# EAGLE design Servorino (EAGLE 9.6.2)
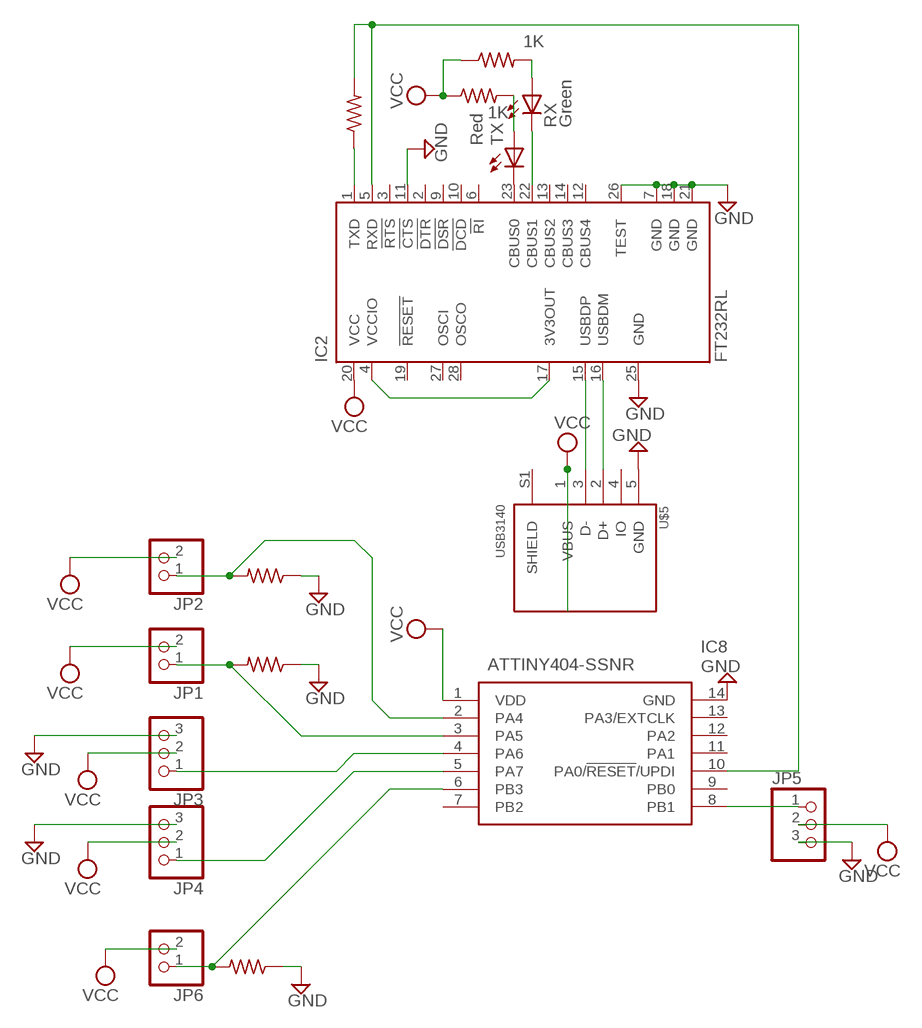
[diagram p0: schematic, sheet 1]

## Parts
IC2  FT232RL  [SSOP28]
IC8  ATTINY404-SSNR  [SOIC127P600X175-14N]
JP1  PINHD-1X2  [1X02]
JP2  PINHD-1X2  [1X02]
JP3  PINHD-1X3  [1X03]
JP4  PINHD-1X3  [1X03]
JP5  PINHD-1X3  [1X03]
JP6  PINHD-1X2  [1X02]
R1  470  R-US_R0805  [R0805]
R2  1K  R-US_R0805  [R0805]
R3  1K  R-US_R0805  [R0805]
R4  470  R-US_R0805  [R0805]
R5  470  R-US_R0805  [R0805]
R6  470  R-US_R0805  [R0805]
RX  Green  LEDCHIP-LED0805  [CHIP-LED0805]
TX  Red  LEDCHIP-LED0805  [CHIP-LED0805]
U$5  USB3140  [USB3140-30-0170-0-C]

## Nets
GND: IC2.7(GND) IC2.11(!CTS) IC2.18(GND) IC2.21(GND) IC2.25(GND) IC2.26(TEST) IC8.14(GND) JP3.3 JP4.3 JP5.3 R4.1 R5.1 R6.1 U$5.5(GND)
N$1: IC8.2(PA4) JP2.1 R6.2
N$2: IC8.6(PB3) JP6.1 R4.2
N$3: IC8.8(PB1) JP5.1
N$4: IC8.3(PA5) JP1.1 R5.2
N$5: IC8.4(PA6) JP3.1
N$6: IC8.5(PA7) JP4.1
N$99: IC2.16(USBDM) U$5.2(D+)
N$100: IC2.15(USBDP) U$5.3(D-)
N$101: IC2.4(VCCIO) IC2.17(3V3OUT)
N$102: IC2.1(TXD) R1.1
N$103: IC2.5(RXD) IC8.10(PA0/!RESET!/UPDI) R1.2
N$104: R2.2 RX.A
N$105: R3.2 TX.A
N$106: IC2.23(CBUS0) TX.C
N$107: IC2.22(CBUS1) RX.C
VCC: IC2.20(VCC) IC8.1(VDD) JP1.2 JP2.2 JP3.2 JP4.2 JP5.2 JP6.2 R2.1 R3.1 U$5.1(VBUS)
Unconnected: IC2.2(!DTR) IC2.3(!RTS) IC2.6(!RI) IC2.9(!DSR) IC2.10(!DCD) IC2.12(CBUS4) IC2.13(CBUS2) IC2.14(CBUS3) IC2.19(!RESET) IC2.27(OSCI) IC2.28(OSCO) IC8.7(PB2) IC8.9(PB0) IC8.11(PA1) IC8.12(PA2) IC8.13(PA3/EXTCLK) U$5.4(IO) U$5.S1(SHIELD)

## Library data of the parts
IC2 = ftdichip:FT232R: Source: http://www.ftdichip.com/Documents/DataSheets/DS_FT232R_v104.pdf; MPN: FT232RL; OC_FARNELL: 1146032; OC_NEWARK: 91K9918
IC8 = SamacSys_Parts:ATTINY404-SSNR: MICROCHIP - ATTINY404-SSNR - MCU, 8BIT, 20MHZ, SOIC-14 Source: Datasheet <https://datasheet.datasheetarchive.com/originals/distributors/DKDS-39/8204.pdf>; DESCRIPTION: MICROCHIP - ATTINY404-SSNR - MCU, 8BIT, 20MHZ, SOIC-14; HEIGHT: 1.75mm; MANUFACTURER_NAME: Microchip; MANUFACTURER_PART_NUMBER: ATTINY404-SSNR; MOUSER_PART_NUMBER: 556-ATTINY404-SSNR; MOUSER_PRICE-STOCK: https://www.mouser.co.uk/ProductDetail/Microchip-Technology-Atmel/ATTINY404-SSNR?qs=F5EMLAvA7IAEqD7Aw0z%252B9Q%3D%3D
JP1 JP2 JP6 = pinhead:PINHD-1X2: PIN HEADER
JP3-JP5 = pinhead:PINHD-1X3: PIN HEADER
R1-R6 = adafruit:R-US_: RESISTOR, American symbol
RX TX = adafruit:LED: LED OSRAM: - CHIPLED LG R971, LG N971, LY N971, LG Q971, LY Q971, LO R971, LY R971 LH N974, LH R974 LS Q976, LO Q976, LY Q976 LO Q996 - Hyper CHIPLED LW Q18S LB Q993, LB Q99A, LB R99A - SideLED LS A670, LO A670, LY A670, LG A670, LP A670 LB A673, LV A673, LT A673, LW A673 LH A674 LY A675 LS A676, LA A676, LO A676, LY A676, LW A676 LS A679, LY A679, LG A679 - Hyper Micro SIDELED® LS Y876, LA Y876, LO Y876, LY Y876 LT Y87S - SmartLED LW L88C, LW L88S LB L89C, LB L89S, LG L890 LS L89K, LO L89K, LY L89K LS L896, LA L896, LO L896, LY L896 - TOPLED LS T670, LO T670, LY T670, LG T670, LP T670 LSG T670, LSP T670, LSY T670, LOP T670, LYG T670 LG T671, LOG T671, LSG T671 LB T673, LV T673, LT T673, LW T673 LH T674 LS T676, LA T676, LO T676, LY T676, LB T676, LH T676, LSB T676, LW T676 LB T67C, LV T67C, LT T67C, LS T67K, LO T67K, LY T67K, LW E67C LS E67B, LA E67B, LO E67B, LY E67B, LB E67C, LV E67C, LT E67C LW T67C LS T679, LY T679, LG T679 LS T770, LO T770, LY T770, LG T770, LP T770 LB T773, LV T773, LT T773, LW T773 LH T774 LS E675, LA E675, LY E675, LS T675 LS T776, LA T776, LO T776, LY T776, LB T776 LHGB T686 LT T68C, LB T68C - Hyper Mini TOPLED® LB M676 - Mini TOPLED Santana® LG M470 LS M47K, LO M47K, LY M47K Source: http://www.osram.convergy.de/
U$5 = USB:USB3140

## Board
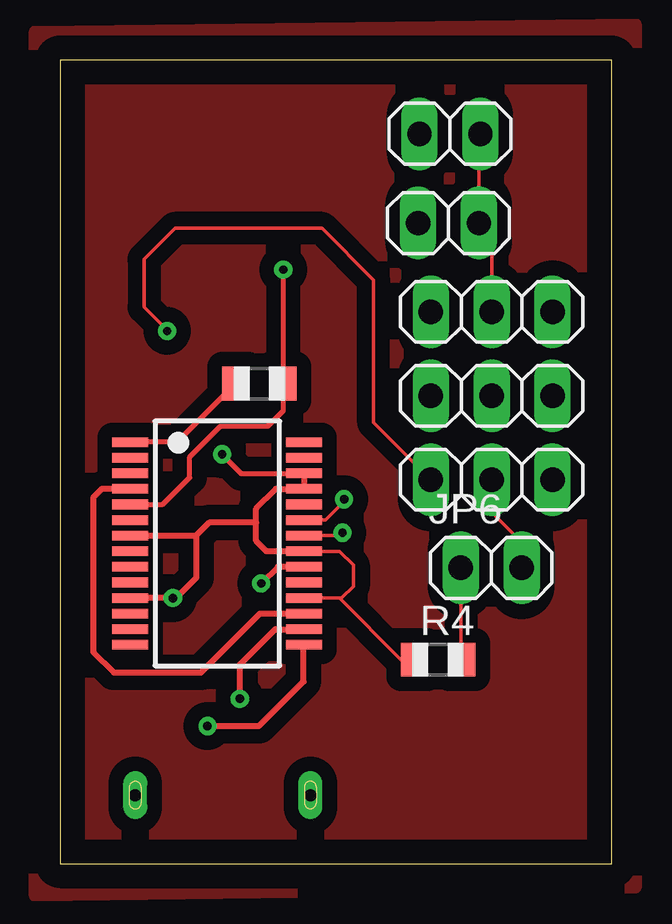
[diagram p1: board, top side]
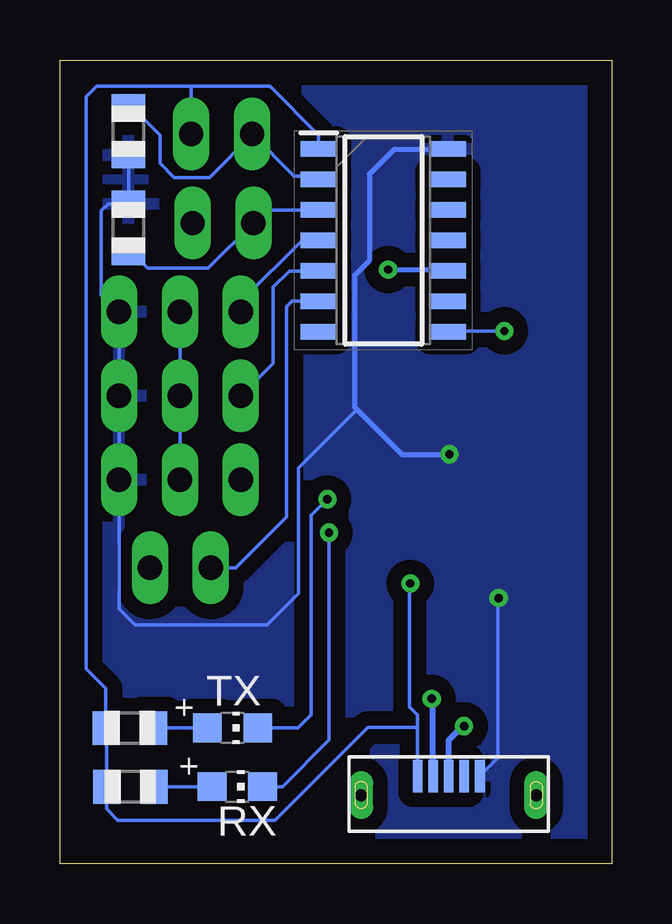
[diagram p2: board, bottom side, seen from below]

Size 23 x 33.5 mm. Coordinates in mm from the lower left corner, seen from the top.
Outline: 0,0 23,0 23,33.5 0,33.5 0,0
Copper layers (1*16): Top 0.035mm / dielectric 1.5mm / Bottom 0.035mm
Design rules "default": minimum track width 6mil, minimum drill 0.35mm, track to track 6mil, track to pad 6mil, pad to pad 6mil, via to via 6mil, smd to smd 6mil, copper to edge 40mil, drill to drill 6mil, minimum pad ring 10mil, minimum via ring 8mil, stop-mask expansion 4mil, vias tented up to drill 0mil, thermal gap 10mil

### Footprints (pad centres in the part's own frame; a part is rotated, then mirrored left to right if it is on the bottom)
SSOP28 = smd 0.4 x 1.5: 1 -4.225,-3.625; 2 -3.575,-3.625; 3 -2.925,-3.625; 4 -2.275,-3.625; 5 -1.625,-3.625; 6 -0.975,-3.625; 7 -0.325,-3.625; 8 0.325,-3.625; 9 0.975,-3.625; 10 1.625,-3.625; 11 2.275,-3.625; 12 2.925,-3.625; 13 3.575,-3.625; 14 4.225,-3.625; 15 4.225,3.625; 16 3.575,3.625; 17 2.925,3.625; 18 2.275,3.625; 19 1.625,3.625; 20 0.975,3.625; 21 0.325,3.625; 22 -0.325,3.625; 23 -0.975,3.625; 24 -1.625,3.625; 25 -2.275,3.625; 26 -2.925,3.625; 27 -3.575,3.625; 28 -4.225,3.625
SOIC127P600X175-14N = smd 1.5 x 0.65: 1 -2.7,3.81; 2 -2.7,2.54; 3 -2.7,1.27; 4 -2.7,0; 5 -2.7,-1.27; 6 -2.7,-2.54; 7 -2.7,-3.81; 8 2.7,-3.81; 9 2.7,-2.54; 10 2.7,-1.27; 11 2.7,0; 12 2.7,1.27; 13 2.7,2.54; 14 2.7,3.81
1X02 = drill 1.016 long: 1 -1.27,0; 2 1.27,0
1X03 = drill 1.016 long: 1 -2.54,0; 2 0,0; 3 2.54,0
R0805 = smd 1.1 x 1.4: 1 -1,0; 2 1,0
CHIP-LED0805 = smd 1.2 x 1.2: A 0,-1.05; C 0,1.05
USB3140-30-0170-0-C = smd 0.4 x 1.35: 1 -1.3,0; 2 -0.65,0; 3 0,0; 4 0.65,0; 5 1.3,0 | drill 0.5 pad 0.775 long: S1 3.65,-0.8; S3 -3.65,-0.8

### Placement (x,y rotation side)
IC2  6.56,13.35 270 top
IC8  9.51,25.98 0 bottom
JP1  16.2,26.7 0 top
JP2  16.26,30.42 0 top
JP3  18,23 0 top
JP4  18,19.5 0 top
JP5  18,16 0 top
JP6  17.98,12.33 0 top
R1  8.32,20.01 0 top
R2  20.06,3.2 0 bottom
R3  20.09,5.65 0 bottom
R4  15.77,8.5 0 top
R5  20.14,26.5 270 bottom
R6  20.14,30.53 90 bottom
RX  15.61,3.21 270 bottom
TX  15.8,5.66 270 bottom
U$5  6.79,3.65 0 bottom

### Tracks (layer width: path | path; a pad name or v marks a point on that pad's centre or on a via)
GND  (via drill 0.35)
  Top 0.152: IC2.21 11.65,13.02 12.23,12.44 12.23,11.56 11.74,11.07 11.65,11.07 | 11.65,11.07 IC2.18 | R4.1 14.22,8.5 11.65,11.07
  Top 0.2: v6.76,17.06 7.56,16.26 10.18,16.26
  Top 0.254: IC2.21 8.61,13.02 8.18,13.45 8.18,14.21 | 8.18,14.21 8.18,14.8 9,15.62 IC2.25 IC2.26 10.18,16.26 | 8.18,14.21 6.22,14.21 5.68,13.67 | IC2.7 5.68,13.67 | 5.68,13.67 5.68,11.91 4.84,11.07 v4.71,11.07 IC2.11
  Bottom 0.152: U$5.5 4.74,4.4 4.74,11.09 4.73,11.09 v4.71,11.07 | 20.54,22.96 JP4.3 JP5.3 20.54,10.61 19.87,9.94 14.37,9.94 13.05,11.26 13.05,16.48 10.61,18.93 | 20.54,22.96 JP3.3 | 20.54,22.96 21.28,23.7 21.28,27.22 21,27.5 R5.1 R6.1
  Bottom 0.2: v6.76,17.06 8.74,17.06 10.61,18.93 10.72,19.04 10.72,24.52 10.1,25.14 10.1,28.74 9.05,29.79 IC8.14
  pour Bottom (isolate 0.61): -1,35 24,35 23.58,-1.17 -1.56,-1.17
N$1
  Bottom 0.152: R6.2 19.99,31.53 18.82,30.36 18.82,29.19 18.23,28.6 16.77,28.6 14.99,30.38 JP2.1 13.23,28.66 12.36,28.66 IC8.2
N$2
  Top 0.152: JP6.1 16.71,8.56 R4.2
  Bottom 0.152: IC8.6 13.33,23.44 13.56,23.21 13.56,14.44 15.67,12.33 JP6.1
N$3  (via drill 0.35)
  Top 0.152: JP5.1 13.08,18.38 13.08,24.32 10.92,26.48 4.8,26.48 3.51,25.19 3.51,23.19 4.47,22.23 v4.47,22.2
  Bottom 0.152: v4.47,22.2 6.78,22.2 IC8.8
N$4
  Bottom 0.152: IC8.3 14.38,27.25 JP1.1 16.82,24.81 19.34,24.81 20.03,25.5 R5.2
N$5
  Bottom 0.152: JP3.1 15.46,23.42 12.84,26.04 12.28,26.04 IC8.4
N$6
  Bottom 0.152: JP4.1 14.11,20.85 14.11,24.03 13.43,24.71 IC8.5
N$99  (via drill 0.35)
  Top 0.254: v7.5,6.87 7.5,8.3 8.97,9.77 IC2.16
  Bottom 0.254: U$5.2 7.44,6.81 v7.5,6.87
N$100  (via drill 0.35)
  Top 0.254: IC2.15 10.17,9.12 10.16,9.11 10.16,7.59 8.3,5.73 v6.15,5.73
  Bottom 0.254: U$5.3 6.79,5.15 6.18,5.76 v6.15,5.73
N$101
  Top 0.254: IC2.4 1.74,15.62 1.39,15.27 1.39,8.81 2.24,7.96 5.88,7.96 8.34,10.42 IC2.17
N$102
  Top 0.2: R1.1 4.88,17.57 IC2.1
N$103  (via drill 0.35)
  Top 0.2: IC2.5 4.29,14.97 5.41,16.09 5.41,16.95 6.69,18.23 8.67,18.23 9.32,18.88 R1.2 9.32,24.71 9.29,24.74 v9.31,24.76
  Bottom 0.2: v9.31,24.76 6.87,24.76 IC8.10
N$104
  Bottom 0.152: R2.2 16.67,3.2 RX.A
N$105
  Bottom 0.152: R3.2 TX.A
N$106  (via drill 0.35)
  Top 0.152: IC2.23 11.08,14.32 11.85,15.09 v11.85,15.19
  Bottom 0.152: TX.C 13.07,5.66 12.53,6.2 12.53,14.51 v11.85,15.19
N$107  (via drill 0.35)
  Top 0.152: IC2.22 11.67,13.68 v11.78,13.79
  Bottom 0.152: RX.C 13.72,3.21 11.78,5.15 v11.78,13.79
TOPSIGNAL
  pour Top (isolate 0.61): -1.05,34.68 24,35 24,-1 -1.05,-1.35
VCC  (via drill 0.35)
  Top 0.152: JP5.2 18,14.64 19.25,13.39 JP6.2 | JP2.2 17.47,30.36 JP1.2 18,26.17 JP3.2
  Top 0.254: IC2.20 9.08,12.37 v8.39,11.68
  Bottom 0.152: U$5.1 8.09,5.61 | 8.09,5.61 8.09,6.2 8.43,6.54 8.43,11.64 v8.39,11.68 | 8.09,5.61 8.15,5.67 10.16,5.67 14.03,1.8 20.59,1.8 21.06,2.27 R2.1 21.06,5.62 R3.1 21.09,7.3 21.91,8.12 21.91,31.96 21.47,32.4 17.53,32.4 | JP3.2 JP4.2 JP5.2 | IC8.1 12.21,30.36 14.25,32.4 17.53,32.4 | JP2.2 17.53,32.4